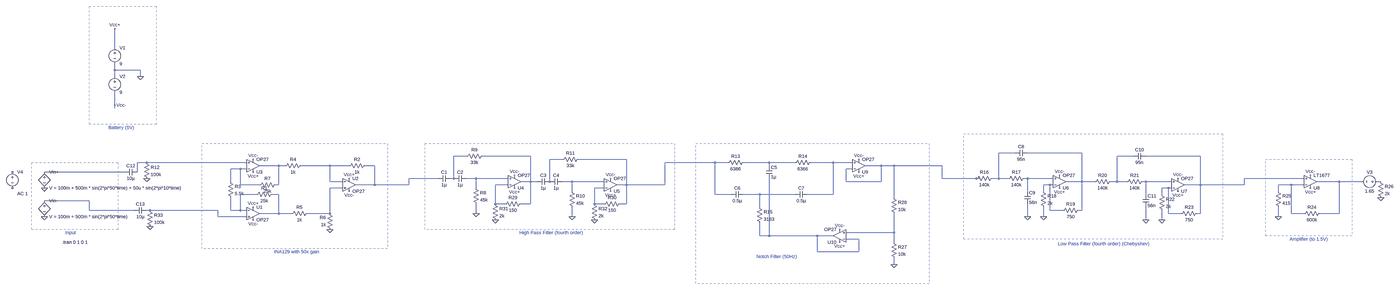
[diagram p0: schematic Prototype2.asc, whole sheet]
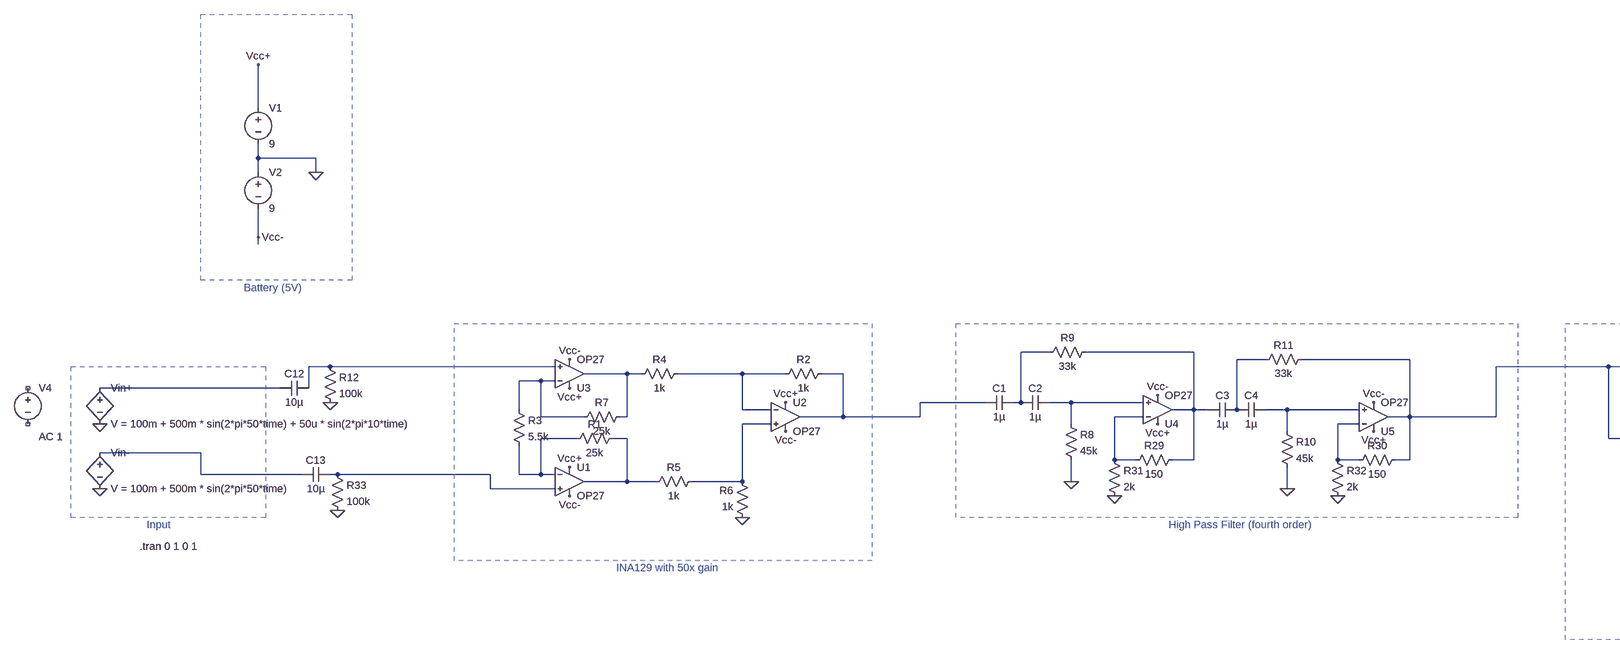
[diagram p1: schematic Prototype2.asc, part, row 1 of 1, column 1 of 2]
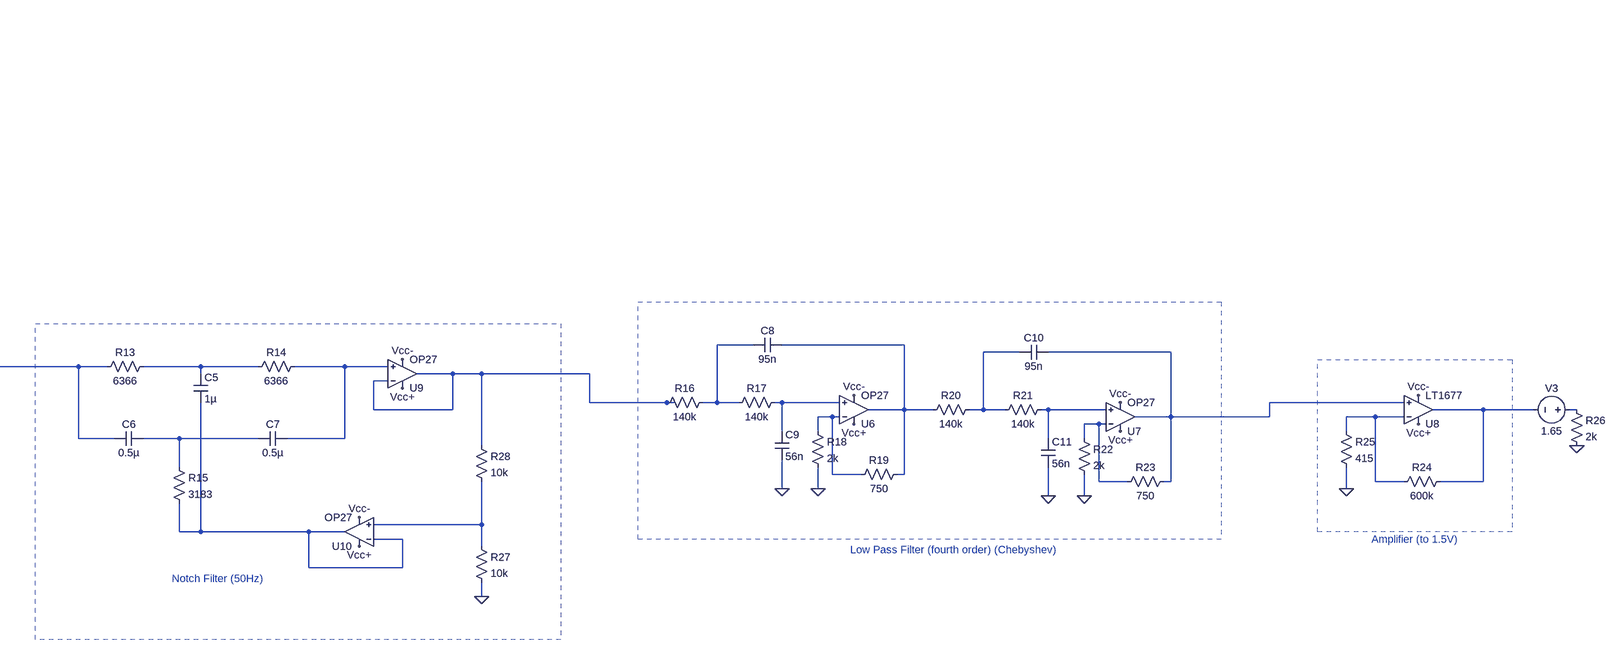
[diagram p2: schematic Prototype2.asc, part, row 1 of 1, column 2 of 2]
Prototype2.asc, the LTspice schematic file:
Version 4.1
SHEET 1 6932 680
WIRE -208 -640 -208 -736
WIRE -208 -528 -208 -560
WIRE -80 -528 -208 -528
WIRE -208 -496 -208 -528
WIRE -80 -496 -80 -528
WIRE -208 -352 -208 -416
WIRE -208 -336 -208 -352
WIRE 4560 -112 4480 -112
WIRE 4896 -112 4624 -112
WIRE 1744 -96 1680 -96
WIRE 2064 -96 1824 -96
WIRE 5152 -96 5072 -96
WIRE 5488 -96 5216 -96
WIRE 2224 -80 2160 -80
WIRE 2544 -80 2304 -80
WIRE -48 -64 -96 -64
WIRE 560 -64 -48 -64
WIRE 3024 -64 2736 -64
WIRE 3088 -64 3024 -64
WIRE 3296 -64 3168 -64
WIRE 3424 -64 3296 -64
WIRE 3616 -64 3504 -64
WIRE 3712 -64 3616 -64
WIRE 720 -48 624 -48
WIRE 752 -48 720 -48
WIRE 976 -48 832 -48
WIRE 1072 -48 976 -48
WIRE 1200 -48 1152 -48
WIRE 3296 -48 3296 -64
WIRE 3856 -48 3776 -48
WIRE 3920 -48 3856 -48
WIRE 4160 -48 3920 -48
WIRE 528 -32 480 -32
WIRE 560 -32 528 -32
WIRE 3712 -32 3680 -32
WIRE -160 -16 -560 -16
WIRE -96 -16 -96 -64
WIRE 1600 16 1456 16
WIRE 1680 16 1680 -96
WIRE 1680 16 1664 16
WIRE 1792 16 1744 16
WIRE 1952 16 1792 16
WIRE 4160 16 4160 -48
WIRE 4368 16 4160 16
WIRE 4384 16 4368 16
WIRE 4480 16 4480 -112
WIRE 4480 16 4448 16
WIRE 4528 16 4480 16
WIRE 4624 16 4608 16
WIRE 4752 16 4624 16
WIRE 6128 16 5744 16
WIRE 480 32 480 -32
WIRE 976 32 976 -48
WIRE 1040 32 976 32
WIRE 2064 32 2064 -96
WIRE 2064 32 2016 32
WIRE 2096 32 2064 32
WIRE 2160 32 2160 -80
WIRE 2272 32 2224 32
WIRE 2432 32 2272 32
WIRE 3680 32 3680 -32
WIRE 3856 32 3856 -48
WIRE 3856 32 3680 32
WIRE 4896 32 4896 -112
WIRE 4896 32 4816 32
WIRE 4960 32 4896 32
WIRE 5072 32 5072 -96
WIRE 5072 32 5040 32
WIRE 5120 32 5072 32
WIRE 5216 32 5200 32
WIRE 5344 32 5216 32
WIRE 6304 32 6192 32
WIRE 6416 32 6304 32
WIRE 6512 32 6496 32
WIRE 528 48 528 -32
WIRE 624 48 528 48
WIRE 720 48 720 -48
WIRE 720 48 704 48
WIRE 1200 48 1200 -48
WIRE 1200 48 1104 48
WIRE 1456 48 1456 16
WIRE 1456 48 1200 48
WIRE 1952 48 1888 48
WIRE 2544 48 2544 -80
WIRE 2544 48 2496 48
WIRE 2736 48 2736 -64
WIRE 2736 48 2544 48
WIRE 4736 48 4704 48
WIRE 4752 48 4736 48
WIRE 5488 48 5488 -96
WIRE 5488 48 5408 48
WIRE 5744 48 5744 16
WIRE 5744 48 5488 48
WIRE 6064 48 6000 48
WIRE 6128 48 6064 48
WIRE 1040 64 976 64
WIRE 1792 64 1792 16
WIRE 2432 64 2384 64
WIRE 5328 64 5296 64
WIRE 5344 64 5328 64
WIRE 2272 80 2272 32
WIRE 4624 80 4624 16
WIRE 4704 80 4704 48
WIRE 6000 80 6000 48
WIRE 608 96 528 96
WIRE 720 96 688 96
WIRE 3024 96 3024 -64
WIRE 3104 96 3024 96
WIRE 3248 96 3168 96
WIRE 3424 96 3248 96
WIRE 3616 96 3616 -64
WIRE 3616 96 3488 96
WIRE 5216 96 5216 32
WIRE 5296 96 5296 64
WIRE 3920 112 3920 -48
WIRE -336 128 -560 128
WIRE 1888 144 1888 48
WIRE 1936 144 1888 144
WIRE 2064 144 2064 32
WIRE 2064 144 2016 144
WIRE 2384 144 2384 64
WIRE 2432 144 2384 144
WIRE 2544 144 2544 48
WIRE 2544 144 2512 144
WIRE 3248 160 3248 96
WIRE -336 176 -336 128
WIRE -112 176 -336 176
WIRE -32 176 -48 176
WIRE 416 176 -32 176
WIRE 480 176 480 112
WIRE 528 176 528 96
WIRE 528 176 480 176
WIRE 560 176 528 176
WIRE 4736 176 4736 48
WIRE 4800 176 4736 176
WIRE 4896 176 4896 32
WIRE 4896 176 4880 176
WIRE 720 192 720 96
WIRE 720 192 624 192
WIRE 784 192 720 192
WIRE 976 192 976 64
WIRE 976 192 864 192
WIRE 1792 192 1792 144
WIRE 5328 192 5328 64
WIRE 5392 192 5328 192
WIRE 5488 192 5488 48
WIRE 5488 192 5472 192
WIRE 6064 192 6064 48
WIRE 6128 192 6064 192
WIRE 6304 192 6304 32
WIRE 6304 192 6208 192
WIRE 416 208 416 176
WIRE 560 208 416 208
WIRE 2272 208 2272 160
WIRE 4624 208 4624 144
WIRE 4704 208 4704 160
WIRE 6000 208 6000 160
WIRE 5216 224 5216 160
WIRE 5296 224 5296 176
WIRE 3920 288 3920 192
WIRE 3920 288 3680 288
WIRE 3248 304 3248 240
WIRE 3296 304 3296 16
WIRE 3296 304 3248 304
WIRE 3536 304 3296 304
WIRE 3616 304 3536 304
WIRE 3744 320 3680 320
WIRE 3920 336 3920 288
WIRE 3536 384 3536 304
WIRE 3744 384 3744 320
WIRE 3744 384 3536 384
WIRE 3920 448 3920 416
FLAG -560 64 0
FLAG -560 208 0
FLAG -80 -496 0
FLAG -208 -736 Vcc+
FLAG -208 -352 Vcc-
FLAG 1792 192 0
FLAG 2272 208 0
FLAG 1984 64 Vcc+
FLAG 2464 80 Vcc+
FLAG 1984 0 Vcc-
FLAG 2464 16 Vcc-
FLAG 4624 208 0
FLAG 4704 208 0
FLAG 4784 64 Vcc+
FLAG 4784 0 Vcc-
FLAG 5216 224 0
FLAG 5296 224 0
FLAG 5376 80 Vcc+
FLAG 5376 16 Vcc-
FLAG 6000 208 0
FLAG 6160 0 Vcc-
FLAG 6160 64 Vcc+
FLAG 6512 112 0
FLAG 3920 448 0
FLAG 3744 -16 Vcc+
FLAG 3648 336 Vcc+
FLAG 3648 272 Vcc-
FLAG 3744 -80 Vcc-
FLAG 1888 224 0
FLAG 2384 224 0
FLAG -48 16 0
FLAG 976 272 0
FLAG 592 -16 Vcc+
FLAG 592 160 Vcc+
FLAG 1072 16 Vcc+
FLAG 592 -80 Vcc-
FLAG 592 224 Vcc-
FLAG 1072 80 Vcc-
FLAG -32 256 0
SYMBOL bv -560 -32 R0
SYMATTR InstName Vin+
SYMATTR Value V = 100m + 500m * sin(2*pi*50*time) + 50u * sin(2*pi*10*time)
SYMBOL bv -560 112 R0
SYMATTR InstName Vin-
SYMATTR Value V = 100m + 500m * sin(2*pi*50*time)
SYMBOL voltage -208 -656 R0
SYMATTR InstName V1
SYMATTR Value 9
SYMBOL voltage -208 -512 R0
SYMATTR InstName V2
SYMATTR Value 9
SYMBOL cap 1664 0 R90
WINDOW 0 0 32 VBottom 2
WINDOW 3 32 32 VTop 2
SYMATTR InstName C1
SYMATTR Value 1µ
SYMBOL cap 1744 0 R90
WINDOW 0 0 32 VBottom 2
WINDOW 3 32 32 VTop 2
SYMATTR InstName C2
SYMATTR Value 1µ
SYMBOL OpAmps\\OP27 1984 96 M180
SYMATTR InstName U4
SYMBOL res 1776 48 R0
SYMATTR InstName R8
SYMATTR Value 45k
SYMBOL cap 2160 16 R90
WINDOW 0 0 32 VBottom 2
WINDOW 3 32 32 VTop 2
SYMATTR InstName C3
SYMATTR Value 1µ
SYMBOL cap 2224 16 R90
WINDOW 0 0 32 VBottom 2
WINDOW 3 32 32 VTop 2
SYMATTR InstName C4
SYMATTR Value 1µ
SYMBOL OpAmps\\OP27 2464 112 M180
SYMATTR InstName U5
SYMBOL res 2256 64 R0
SYMATTR InstName R10
SYMATTR Value 45k
SYMBOL res 3184 -80 R90
WINDOW 0 0 56 VBottom 2
WINDOW 3 32 56 VTop 2
SYMATTR InstName R13
SYMATTR Value 6366
SYMBOL res 3520 -80 R90
WINDOW 0 0 56 VBottom 2
WINDOW 3 32 56 VTop 2
SYMATTR InstName R14
SYMATTR Value 6366
SYMBOL cap 3280 -48 R0
SYMATTR InstName C5
SYMATTR Value 1µ
SYMBOL cap 3168 80 R90
WINDOW 0 0 32 VBottom 2
WINDOW 3 32 32 VTop 2
SYMATTR InstName C6
SYMATTR Value 0.5µ
SYMBOL cap 3488 80 R90
WINDOW 0 0 32 VBottom 2
WINDOW 3 32 32 VTop 2
SYMATTR InstName C7
SYMATTR Value 0.5µ
SYMBOL res 3232 144 R0
SYMATTR InstName R15
SYMATTR Value 3183
SYMBOL OpAmps\\OP27 4784 96 M180
SYMATTR InstName U6
SYMBOL res 4464 0 R90
WINDOW 0 0 56 VBottom 2
WINDOW 3 32 56 VTop 2
SYMATTR InstName R16
SYMATTR Value 140k
SYMBOL res 4624 0 R90
WINDOW 0 0 56 VBottom 2
WINDOW 3 32 56 VTop 2
SYMATTR InstName R17
SYMATTR Value 140k
SYMBOL cap 4624 -128 R90
WINDOW 0 0 32 VBottom 2
WINDOW 3 32 32 VTop 2
SYMATTR InstName C8
SYMATTR Value 95n
SYMBOL cap 4608 80 R0
SYMATTR InstName C9
SYMATTR Value 56n
SYMBOL res 4688 64 R0
SYMATTR InstName R18
SYMATTR Value 2k
SYMBOL res 4896 160 R90
WINDOW 0 0 56 VBottom 2
WINDOW 3 32 56 VTop 2
SYMATTR InstName R19
SYMATTR Value 750
SYMBOL OpAmps\\OP27 5376 112 M180
SYMATTR InstName U7
SYMBOL res 5056 16 R90
WINDOW 0 0 56 VBottom 2
WINDOW 3 32 56 VTop 2
SYMATTR InstName R20
SYMATTR Value 140k
SYMBOL res 5216 16 R90
WINDOW 0 0 56 VBottom 2
WINDOW 3 32 56 VTop 2
SYMATTR InstName R21
SYMATTR Value 140k
SYMBOL cap 5216 -112 R90
WINDOW 0 0 32 VBottom 2
WINDOW 3 32 32 VTop 2
SYMATTR InstName C10
SYMATTR Value 95n
SYMBOL cap 5200 96 R0
SYMATTR InstName C11
SYMATTR Value 56n
SYMBOL res 5280 80 R0
SYMATTR InstName R22
SYMATTR Value 2k
SYMBOL res 5488 176 R90
WINDOW 0 0 56 VBottom 2
WINDOW 3 32 56 VTop 2
SYMATTR InstName R23
SYMATTR Value 750
SYMBOL OpAmps\\LT1677 6160 96 M180
SYMATTR InstName U8
SYMBOL res 6224 176 R90
WINDOW 0 0 56 VBottom 2
WINDOW 3 32 56 VTop 2
SYMATTR InstName R24
SYMATTR Value 600k
SYMBOL res 5984 64 R0
SYMATTR InstName R25
SYMATTR Value 415
SYMBOL res 6496 16 R0
SYMATTR InstName R26
SYMATTR Value 2k
SYMBOL voltage 6512 32 R90
WINDOW 0 -32 56 VBottom 2
WINDOW 3 32 56 VTop 2
SYMATTR InstName V3
SYMATTR Value 1.65
SYMBOL cap -96 -32 R90
WINDOW 0 0 32 VBottom 2
WINDOW 3 32 32 VTop 2
SYMATTR InstName C12
SYMATTR Value 10µ
SYMBOL res -64 -80 R0
SYMATTR InstName R12
SYMATTR Value 100k
SYMBOL voltage -720 -32 R0
WINDOW 123 24 124 Left 2
WINDOW 39 0 0 Left 0
SYMATTR Value2 AC 1
SYMATTR InstName V4
SYMATTR Value ""
SYMBOL OpAmps\\OP27 3744 16 M180
SYMATTR InstName U9
SYMBOL OpAmps\\OP27 3648 368 R180
SYMATTR InstName U10
SYMBOL res 3904 320 R0
SYMATTR InstName R27
SYMATTR Value 10k
SYMBOL res 3904 96 R0
SYMATTR InstName R28
SYMATTR Value 10k
SYMBOL res 1840 -112 R90
WINDOW 0 0 56 VBottom 2
WINDOW 3 32 56 VTop 2
SYMATTR InstName R9
SYMATTR Value 33k
SYMBOL res 2320 -96 R90
WINDOW 0 0 56 VBottom 2
WINDOW 3 32 56 VTop 2
SYMATTR InstName R11
SYMATTR Value 33k
SYMBOL res 2032 128 R90
WINDOW 0 0 56 VBottom 2
WINDOW 3 32 56 VTop 2
SYMATTR InstName R29
SYMATTR Value 150
SYMBOL res 2528 128 R90
WINDOW 0 0 56 VBottom 2
WINDOW 3 32 56 VTop 2
SYMATTR InstName R30
SYMATTR Value 150
SYMBOL res 1872 128 R0
SYMATTR InstName R31
SYMATTR Value 2k
SYMBOL res 2368 128 R0
SYMATTR InstName R32
SYMATTR Value 2k
SYMBOL OpAmps\\OP27 592 128 R0
SYMATTR InstName U1
SYMBOL OpAmps\\OP27 1072 -16 R0
SYMATTR InstName U2
SYMBOL OpAmps\\OP27 592 16 M180
SYMATTR InstName U3
SYMBOL res 704 80 R90
WINDOW 0 0 56 VBottom 2
WINDOW 3 32 56 VTop 2
SYMATTR InstName R1
SYMATTR Value 25k
SYMBOL res 720 32 R90
WINDOW 0 0 56 VBottom 2
WINDOW 3 32 56 VTop 2
SYMATTR InstName R7
SYMATTR Value 25k
SYMBOL res 464 16 R0
SYMATTR InstName R3
SYMATTR Value 5.5k
SYMBOL res 848 -64 R90
WINDOW 0 0 56 VBottom 2
WINDOW 3 32 56 VTop 2
SYMATTR InstName R4
SYMATTR Value 1k
SYMBOL res 880 176 R90
WINDOW 0 0 56 VBottom 2
WINDOW 3 32 56 VTop 2
SYMATTR InstName R5
SYMATTR Value 1k
SYMBOL res 992 288 R180
WINDOW 0 36 76 Left 2
WINDOW 3 36 40 Left 2
SYMATTR InstName R6
SYMATTR Value 1k
SYMBOL res 1168 -64 R90
WINDOW 0 0 56 VBottom 2
WINDOW 3 32 56 VTop 2
SYMATTR InstName R2
SYMATTR Value 1k
SYMBOL cap -48 160 R90
WINDOW 0 0 32 VBottom 2
WINDOW 3 32 32 VTop 2
SYMATTR InstName C13
SYMATTR Value 10µ
SYMBOL res -48 160 R0
SYMATTR InstName R33
SYMATTR Value 100k
TEXT -456 288 Left 2 ;Input
TEXT -240 -240 Left 2 ;Battery (5V)
TEXT 696 384 Left 2 ;INA129 with 50x gain
TEXT 2008 288 Left 2 ;High Pass Filter (fourth order)
TEXT 3232 408 Left 2 ;Notch Filter (50Hz)
TEXT 4776 344 Left 2 ;Low Pass Filter (fourth order) (Chebyshev)
TEXT 6056 320 Left 2 ;Amplifier (to 1.5V)
TEXT -472 336 Left 2 !.tran 0 1 0 1
RECTANGLE Normal -192 272 -624 -64 2
RECTANGLE Normal -192 272 -624 -64 1
RECTANGLE Normal 0 -256 -336 -848 1
RECTANGLE Normal 1264 368 336 -160 1
RECTANGLE Normal 2784 272 1536 -160 1
RECTANGLE Normal 5600 320 4304 -208 1
RECTANGLE Normal 6368 304 5936 -80 1
RECTANGLE Normal 4096 544 2928 -160 2

The netlist it stands for:
* Prototype2.asc
B§Vin+ N017 0 V = 100m + 500m * sin(2*pi*50*time) + 50u * sin(2*pi*10*time)
B§Vin- N033 0 V = 100m + 500m * sin(2*pi*50*time)
V1 Vcc+ 0 9
V2 0 Vcc- 9
C1 N003 N014 1µ
C2 N018 N003 1µ
X§U4 N018 N024 Vcc+ Vcc- N004 OP27  ; pins In+ In- V+ V- OUT
R8 N018 0 45k
C3 N007 N004 1µ
C4 N020 N007 1µ
X§U5 N020 N028 Vcc+ Vcc- N008 OP27  ; pins In+ In- V+ V- OUT
R10 N020 0 45k
R13 N010 N008 6366
R14 N011 N010 6366
C5 N010 N036 1µ
C6 N032 N008 0.5µ
C7 N011 N032 0.5µ
R15 N032 N036 3183
X§U6 N019 N025 Vcc+ Vcc- N002 OP27  ; pins In+ In- V+ V- OUT
R16 N001 N015 140k
R17 N019 N001 140k
C8 N002 N001 95n
C9 N019 0 56n
R18 N025 0 2k
R19 N002 N025 750
X§U7 N021 N029 Vcc+ Vcc- N006 OP27  ; pins In+ In- V+ V- OUT
R20 N005 N002 140k
R21 N021 N005 140k
C10 N006 N005 95n
C11 N021 0 56n
R22 N029 0 2k
R23 N006 N029 750
X§U8 N006 N026 Vcc+ Vcc- N022 LT1677  ; pins In+ In- V+ V- OUT
R24 N022 N026 600k
R25 N026 0 415
R26 N023 0 2k
V3 N023 N022 1.65
C12 N009 N017 10µ
R12 N009 0 100k
V4 NC_01 NC_02 AC 1
X§U9 N011 N015 Vcc+ Vcc- N015 OP27  ; pins In+ In- V+ V- OUT
X§U10 N035 N036 Vcc+ Vcc- N036 OP27  ; pins In+ In- V+ V- OUT
R27 N035 0 10k
R28 N015 N035 10k
R9 N004 N003 33k
R11 N008 N007 33k
R29 N004 N024 150
R30 N008 N028 150
R31 N024 0 2k
R32 N028 0 2k
X§U1 N034 N030 Vcc+ Vcc- N031 OP27  ; pins In+ In- V+ V- OUT
X§U2 N027 N013 Vcc+ Vcc- N014 OP27  ; pins In+ In- V+ V- OUT
X§U3 N009 N016 Vcc+ Vcc- N012 OP27  ; pins In+ In- V+ V- OUT
R1 N031 N030 25k
R7 N012 N016 25k
R3 N016 N030 5.5k
R4 N013 N012 1k
R5 N027 N031 1k
R6 0 N027 1k
R2 N014 N013 1k
C13 N034 N033 10µ
R33 N034 0 100k
* Input
* Battery (5V)
* INA129 with 50x gain
* High Pass Filter (fourth order)
* Notch Filter (50Hz)
* Low Pass Filter (fourth order) (Chebyshev)
* Amplifier (to 1.5V)
.tran 0 1 0 1
.lib ADI.lib
.lib LTC.lib
.backanno
.end